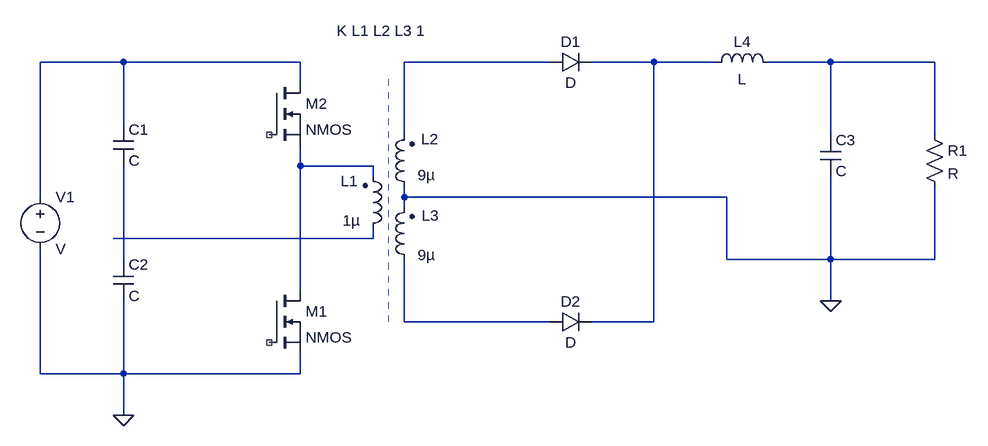
[diagram p0: schematic Draft2.asc]
Draft2.asc, the LTspice schematic file:
Version 4
SHEET 1 1628 680
WIRE 240 -96 112 -96
WIRE 512 -96 240 -96
WIRE 896 -96 672 -96
WIRE 1056 -96 960 -96
WIRE 1152 -96 1056 -96
WIRE 1328 -96 1232 -96
WIRE 1488 -96 1328 -96
WIRE 512 -64 512 -96
WIRE 240 0 240 -96
WIRE 672 16 672 -96
WIRE 1328 16 1328 -96
WIRE 1488 16 1488 -96
WIRE 512 64 512 32
WIRE 624 64 512 64
WIRE 624 80 624 64
WIRE 112 112 112 -96
WIRE 672 112 672 96
WIRE 1168 112 672 112
WIRE 672 128 672 112
WIRE 624 176 624 160
WIRE 624 176 224 176
WIRE 240 208 240 64
WIRE 1168 208 1168 112
WIRE 1328 208 1328 80
WIRE 1328 208 1168 208
WIRE 1488 208 1488 96
WIRE 1488 208 1328 208
WIRE 512 256 512 64
WIRE 1328 272 1328 208
WIRE 672 304 672 208
WIRE 896 304 672 304
WIRE 1056 304 1056 -96
WIRE 1056 304 960 304
WIRE 112 384 112 192
WIRE 240 384 240 272
WIRE 240 384 112 384
WIRE 512 384 512 352
WIRE 512 384 240 384
WIRE 240 448 240 384
FLAG 1328 272 0
FLAG 240 448 0
SYMBOL voltage 112 96 R0
SYMATTR InstName V1
SYMBOL cap 224 0 R0
SYMATTR InstName C1
SYMBOL cap 224 208 R0
SYMATTR InstName C2
SYMBOL nmos 464 256 R0
SYMATTR InstName M1
SYMBOL nmos 464 -64 R0
SYMATTR InstName M2
SYMBOL ind2 608 176 M180
WINDOW 0 -34 89 Left 2
WINDOW 3 -31 28 Left 2
SYMATTR InstName L1
SYMATTR Value 1µ
SYMATTR Type ind
SYMBOL ind2 688 112 R180
WINDOW 0 -37 89 Left 2
WINDOW 3 -32 34 Left 2
SYMATTR InstName L2
SYMATTR Value 9µ
SYMATTR Type ind
SYMBOL ind2 688 224 R180
WINDOW 0 -38 84 Left 2
WINDOW 3 -32 23 Left 2
SYMATTR InstName L3
SYMATTR Value 9µ
SYMATTR Type ind
SYMBOL diode 896 -80 R270
WINDOW 0 32 32 VTop 2
WINDOW 3 0 32 VBottom 2
SYMATTR InstName D1
SYMBOL diode 896 320 R270
WINDOW 0 32 32 VTop 2
WINDOW 3 0 32 VBottom 2
SYMATTR InstName D2
SYMBOL ind 1136 -80 R270
WINDOW 0 32 56 VTop 2
WINDOW 3 5 56 VBottom 2
SYMATTR InstName L4
SYMBOL cap 1312 16 R0
SYMATTR InstName C3
SYMBOL res 1472 0 R0
SYMATTR InstName R1
TEXT 568 -144 Left 2 !K L1 L2 L3 1
LINE Normal 648 304 648 -80 2

The netlist it stands for:
* Draft2.asc
V1 N001 0 V
C1 N001 N007 C
C2 N007 0 C
M1 N005 NC_01 0 0 NMOS
M2 N001 NC_02 N005 N005 NMOS
L1 N006 N005 1µ
L2 0 N002 9µ
L3 N008 0 9µ
D1 N002 N003 D
D2 N008 N003 D
L4 N003 N004 L
C3 N004 0 C
R1 N004 0 R
.model D D
.lib standard.dio
.model NMOS NMOS
.model PMOS PMOS
.lib standard.mos
K L1 L2 L3 1
.backanno
.end